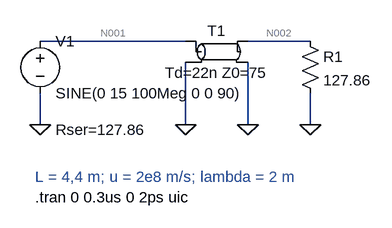
[diagram p0: schematic Q2a.asc]
Q2a.asc, the LTspice schematic file:
Version 4
SHEET 1 880 700
WIRE 96 128 -128 128
WIRE 288 128 192 128
WIRE -128 256 -128 208
WIRE 96 256 96 160
WIRE 192 256 192 160
WIRE 288 256 288 208
FLAG -128 256 0
FLAG 96 256 0
FLAG 192 256 0
FLAG 288 256 0
SYMBOL tline 144 144 R0
SYMATTR InstName T1
SYMATTR Value Td=22n Z0=75
SYMBOL res 272 112 R0
SYMATTR InstName R1
SYMATTR Value 127.86
SYMBOL voltage -128 112 R0
WINDOW 123 24 124 Left 2
WINDOW 39 24 152 Left 2
SYMATTR SpiceLine Rser=127.86
SYMATTR InstName V1
SYMATTR Value SINE(0 15 100Meg 0 0 90)
TEXT -136 336 Left 2 ;L = 4,4 m; u = 2e8 m/s; lambda = 2 m
TEXT -136 368 Left 2 !.tran 0 0.3us 0 2ps uic

The netlist it stands for:
* Q2a.asc
T1 N001 0 N002 0 Td=22n Z0=75
R1 N002 0 127.86
V1 N001 0 SINE(0 15 100Meg 0 0 90) Rser=127.86
* L = 4,4 m; u = 2e8 m/s; lambda = 2 m
.tran 0 0.3us 0 2ps uic
.backanno
.end

* Results of the author's LTspice run, read from the files saved beside the schematic
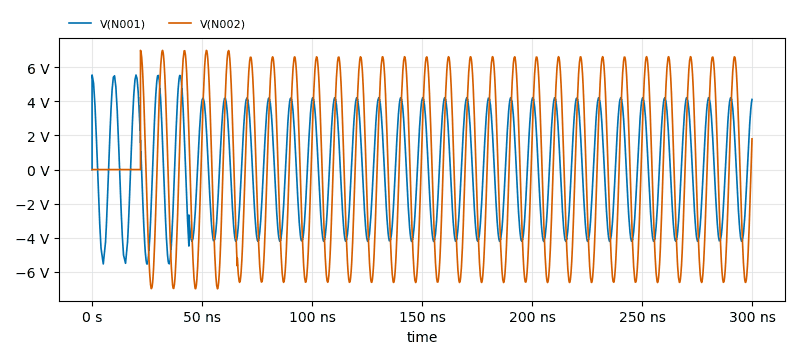
[diagram p1: Transient Analysis of Q2a.asc, plotted from the saved traces]
* Transient Analysis, 1 run:
*   V(N001): min -5.546 V, max 5.546 V, average -3.878 mV, rms 3.127 V, last 4.112 V
*   V(N002): min -6.991 V, max 6.991 V, average -33.77 mV, rms 4.543 V, last 1.801 V